# Altium project WCTopping.PrjPcb (part 1 of 2)
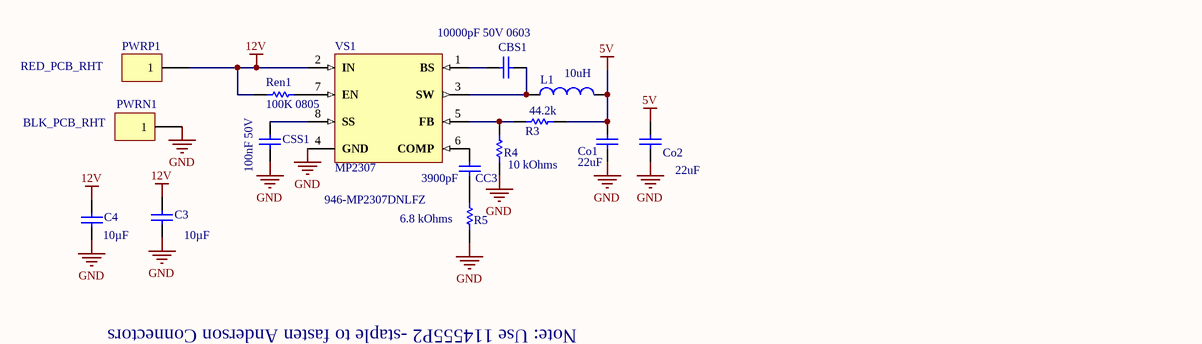
[diagram p0: Power Supply.SchDoc]
Project_Name: WC Topping; Revision: 1.2
5 sheets, 59 parts. Net scope: flat (ports and power ports of the same name join across sheets).
Board files: WCTopping.PcbDoc, WCToppingRouting.PcbDoc
Sheets:
  Power Supply.SchDoc
  Processor_Interface.SchDoc
  CAN_Interface.SchDoc
  Digital_IO.SchDoc
  Relay_IO.SchDoc

## Sheet Power Supply.SchDoc: Power Supply 5V @ 3A
size A; Engineer: H Potential; DocumentNumber: 5; Revision: 3.2; SheetNumber: 5; SheetTotal: 5

### Parts
C3  10µF  [CAPC2013X135X45ML10T25]
C4  10µF  [CAPC2013X135X45ML10T25]
CBS1  10000pF 50V 0603  [0603C_L]
CC3  3900pF  [0603C_L]
Co1  22uF  [0603C_L]
Co2  22uF  [0603C_L]
CSS1  100nF 50V  [0603C_L]
L1  10uH  [IND_1]
PWRN1  BLK_PCB_RHT  [Anderson_BLK_RHT_BOT]
PWRP1  RED_PCB_RHT  [Anderson_Red_RHT_BOT]
R3  44.2k  [0805_L]
R4  10 kOhms  [0805_L]
R5  6.8 kOhms  [0805_L]
Ren1  100K 0805  [0805_L]
VS1  MP2307  Supplier Part Number 1: 946-MP2307DNLFZ  [SOIC8N_EXP]

### Nets
5V: Co1.2 Co2.2 L1.2 R3.1
12V: C3.2 C4.2 PWRP1.1 Ren1.1 VS1.2(IN)
GND: C3.1 C4.1 Co1.1 Co2.1 CSS1.1 PWRN1.1 R4.2 R5.1 VS1.4(GND)
NetCBS1_1: CBS1.1 L1.1 VS1.3(SW)
NetCBS1_2: CBS1.2 VS1.1(BS)
NetCC3_1: CC3.1 R5.2
NetCC3_2: CC3.2 VS1.6(COMP)
NetCSS1_2: CSS1.2 VS1.8(SS)
NetR3_2: R3.2 R4.1 VS1.5(FB)
NetRen1_2: Ren1.2 VS1.7(EN)

### Notes on the sheet
- Note: Use 114555P2 -staple to fasten Anderson Connectors
- Title
- Size:
- Date:
- A
- Project:
- Time:
- Revision:
- Sheet
- of
- Engineer:
- File:

### Library data of the parts
C3 C4 = CMP-2007-03541-1: Part Number: GRM21BR61E106KA73L; Manufacturer: Murata; Product Training Modules: High-Cap Multilayer Ceramic Capacitors; Catalog Drawings: GRM Series_0805_1.25; Tolerance: ±10%; Voltage - Rated: 25V; Temperature Coefficient: X5R; Online Catalog: GRM Series; Other Names: 490-5523-6; Supplier 1: Digikey; Supplier Part Number 1: 490-5523-1-ND; Manufacturer Part Number: GRM21BR61E106KA73L; Stock 1: 750766; Pricing 1: 1=0.19, 10=0.13, 50=0.0748, 100=0.0618, 250=0.052, 500=0.0436, 1000=0.0358 (USD); Standard Package: 1; Category: Capacitors; Family: Ceramic Capacitors; Series: GRM; Packaging: Digi-Reel®; Capacitance: 10µF; Mounting Type: Surface Mount, MLCC; Operating Temperature: -55°C ~ 85°C; Applications: General Purpose; Ratings: -; Package / Case: 0805 (2012 Metric); Size / Dimension: 0.079" L x 0.049" W (2.00mm x 1.25mm); Height - Seated (Max): -; Thickness (Max): 0.053" (1.35mm); Lead Spacing: -; Features: -; Lead Style: -; ComponentLink1URL: https://datasheet.ciiva.com/139/partnumbering-e-01-139184.pdf; ComponentLink1Description: https://datasheet.ciiva.com/139/partnumbering-e-01-139184.pdf; ComponentLink2URL: https://datasheet.ciiva.com/28584/626718-28584288.pdf; ComponentLink2Description: https://datasheet.ciiva.com/28584/626718-28584288.pdf; ComponentLink3URL: https://datasheet.ciiva.com/16440/grm21br61e106ka73l-16440627.pdf; ComponentLink3Description: https://datasheet.ciiva.com/16440/grm21br61e106ka73l-16440627.pdf; ComponentLink4URL: https://datasheet.ciiva.com/7719/1747469-7719093.pdf; ComponentLink4Description: https://datasheet.ciiva.com/7719/1747469-7719093.pdf; ComponentLink5URL: https://datasheet.ciiva.com/5424/product-5424327.pdf; ComponentLink5Description: https://datasheet.ciiva.com/5424/product-5424327.pdf; ComponentLink6URL: https://datasheet.ciiva.com/28584/626718-28584279.pdf; ComponentLink6Description: https://datasheet.ciiva.com/28584/626718-28584279.pdf; ComponentLink7URL: https://datasheet.ciiva.com/14116/grmseries-highdielectrictype-eng-14116376.pdf; ComponentLink7Description: https://datasheet.ciiva.com/14116/grmseries-highdielectrictype-eng-14116376.pdf; ComponentLink8URL: https://datasheet.ciiva.com/22774/1747469-22774396.pdf; ComponentLink8Description: https://datasheet.ciiva.com/22774/1747469-22774396.pdf; ComponentLink9URL: https://datasheet.ciiva.com/139/partnumbering-e-01-139182.pdf; ComponentLink9Description: https://datasheet.ciiva.com/139/partnumbering-e-01-139182.pdf; ComponentLink10URL: https://datasheet.ciiva.com/139/partnumbering-e-01-139183.pdf; ComponentLink10Description: https://datasheet.ciiva.com/139/partnumbering-e-01-139183.pdf; ComponentLink11URL: https://datasheet.ciiva.com/29199/454623-da-01-en-vs-kondensator-0805-29199615.pdf; ComponentLink11Description: https://datasheet.ciiva.com/29199/454623-da-01-en-vs-kondensator-0805-29199615.pdf
CBS1 = Cap10000pF_50V_0603: Manufacturer: Yageo; Manufacturer Part Number: CC0603KRX7R9BB103; Product Training Modules: Multilayer Ceramic Capacitors; Featured Product: Commodity Multilayer Ceramic Capacitors – CC Series; Tolerance: ±10%; Temperature Coefficient: X7R; Online Catalog: CC Series; Other Names: 311-1085-6; Supplier 1: Digikey; Stock 1: 2765337; Pricing 1: 1=0.1, 10=0.018, 25=0.0132, 50=0.0098, 100=0.008, 250=0.0067, 500=0.0057, 1000=0.0045 (USD); Standard Package: 1; Category: Capacitors; Family: Ceramic Capacitors; Series: CC; Packaging: Digi-Reel®; Capacitance: 10000pF; Voltage - Rated: 50V; Mounting Type: Surface Mount, MLCC; Operating Temperature: -55°C ~ 125°C; Applications: General Purpose; Ratings: -; Package / Case: 0603 (1608 Metric); Size / Dimension: 0.063" L x 0.031" W (1.60mm x 0.80mm); Height - Seated (Max): -; Thickness (Max): 0.035" (0.90mm); Lead Spacing: -; Features: -; Lead Style: -; ComponentLink1URL: https://datasheet.ciiva.com/8033/1734573-8033861.pdf; ComponentLink1Description: https://datasheet.ciiva.com/8033/1734573-8033861.pdf; ComponentLink2URL: https://datasheet.ciiva.com/176/mlccorderingcode-176550.pdf; ComponentLink2Description: https://datasheet.ciiva.com/176/mlccorderingcode-176550.pdf; ComponentLink3URL: https://datasheet.ciiva.com/11788/0900766b8079c870-11788374.pdf; ComponentLink3Description: https://datasheet.ciiva.com/11788/0900766b8079c870-11788374.pdf; ComponentLink4URL: https://datasheet.ciiva.com/176/mlccorderingcode-176551.pdf; ComponentLink4Description: https://datasheet.ciiva.com/176/mlccorderingcode-176551.pdf; ComponentLink5URL: https://datasheet.ciiva.com/13389/upy-gphc-x7r-6-3v-to-50v-8-13389991.pdf; ComponentLink5Description: https://datasheet.ciiva.com/13389/upy-gphc-x7r-6-3v-to-50v-8-13389991.pdf; ComponentLink6URL: https://datasheet.ciiva.com/176/mlccorderingcode-176552.pdf; ComponentLink6Description: https://datasheet.ciiva.com/176/mlccorderingcode-176552.pdf; ComponentLink7URL: https://datasheet.ciiva.com/8033/1734573-8033816.pdf; ComponentLink7Description: https://datasheet.ciiva.com/8033/1734573-8033816.pdf; ComponentLink8URL: https://datasheet.ciiva.com/8033/70765-8033817.pdf; ComponentLink8Description: https://datasheet.ciiva.com/8033/70765-8033817.pdf; ComponentLink9URL: https://datasheet.ciiva.com/16625/upy-gphc-x7r-6-3v-to-50v-8-16625529.pdf; ComponentLink9Description: https://datasheet.ciiva.com/16625/upy-gphc-x7r-6-3v-to-50v-8-16625529.pdf; ComponentLink10URL: https://datasheet.ciiva.com/28450/1489800-28450619.pdf; ComponentLink10Description: https://datasheet.ciiva.com/28450/1489800-28450619.pdf; ComponentLink11URL: https://datasheet.ciiva.com/26862/getdatasheetpartid-403582-26862846.pdf; ComponentLink11Description: https://datasheet.ciiva.com/26862/getdatasheetpartid-403582-26862846.pdf; Supplier Part Number 1: 311-1085-1-ND
CC3 = Cap_0603_1: Manufacturer: Murata; Manufacturer Part Number: GRM188R71E392KA01D; Tolerance (+ or -): 10%; Voltage: 25VDC; Temp Coeff (Dielectric): X7R; Case Style: Ceramic Chip; Wire Form: Not Required; Product Length (mm): 1.6mm; Product Depth (mm): 0.8mm; Product Diameter (mm): Not Requiredmm; Supplier 1: Digikey; Supplier Part Number 1: 490-11525-1-ND; Stock 1: 12327; Pricing 1: 1=0.1, 10=0.072, 50=0.039, 100=0.033, 250=0.027, 500=0.0231, 1000=0.018 (USD); Capacitance: 3900pF; Operating Temp Range: -55C to 125C; Mounting Style: Surface Mount; Package / Case: 0603; Construction: SMT Chip; Failure Rate: Not Required; Product Height (mm): 0.8mm; Packaging: Tape and Reel; ComponentLink1URL: https://datasheet.ciiva.com/5420/product-5420128.pdf; ComponentLink1Description: https://datasheet.ciiva.com/5420/product-5420128.pdf; ComponentLink2URL: https://datasheet.ciiva.com/164/partnumbering-e-01-164755.pdf; ComponentLink2Description: https://datasheet.ciiva.com/164/partnumbering-e-01-164755.pdf
Co1 Co2 = Cap_0603_1: Manufacturer: Murata; Manufacturer Part Number: GRM188R60J226MEA0D; Tolerance (+ or -): 20%; Voltage: 6.3VDC; Temp Coeff (Dielectric): X5R; Case Style: Ceramic Chip; Wire Form: Not Required; Product Length (mm): 1.6mm; Product Depth (mm): 0.8mm; Product Diameter (mm): Not Requiredmm; Supplier 1: Digikey; Supplier Part Number 1: 490-7611-1-ND; Stock 1: 2044559; Pricing 1: 1=0.27, 10=0.182, 50=0.11, 100=0.0924, 250=0.0748, 500=0.066, 1000=0.0561 (USD); Capacitance: 22uF; Operating Temp Range: -55C to 125C; Mounting Style: Surface Mount; Package / Case: 0603; Construction: SMT Chip; Failure Rate: Not Required; Product Height (mm): 0.8mm; Packaging: Tape and Reel; ComponentLink1URL: https://datasheet.ciiva.com/29540/partnumbering-e-01-29540441.pdf; ComponentLink1Description: https://datasheet.ciiva.com/29540/partnumbering-e-01-29540441.pdf; ComponentLink2URL: https://datasheet.ciiva.com/29540/partnumbering-e-01-29540442.pdf; ComponentLink2Description: https://datasheet.ciiva.com/29540/partnumbering-e-01-29540442.pdf; ComponentLink3URL: https://datasheet.ciiva.com/29540/partnumbering-e-01-29540443.pdf; ComponentLink3Description: https://datasheet.ciiva.com/29540/partnumbering-e-01-29540443.pdf
CSS1 = Cap100nF_50V_0603: Manufacturer: Yageo; Manufacturer Part Number: CC0603ZRY5V9BB104; Capacitance: 0.10µF; Tolerance: -20%, +80%; Temperature Coefficient: Y5V (F); Supplier 1: Digi-Key; Supplier Part Number 1: 311-1343-1-ND; RoHS: RoHS Compliant; Category: Capacitors; Stock 1: 1827128; Pricing 1: 1=0.1, 10=0.018, 25=0.0128, 100=0.0082, 250=0.00672, 500=0.00574, 1000=0.00447 (USD); Packaging: Cut Tape (CT); Part Status: Active; Voltage - Rated: 50V; Operating Temperature: -30°C ~ 85°C; Features: -; Ratings: -; Applications: General Purpose; Failure Rate: -; Mounting Type: Surface Mount, MLCC; Package / Case: 0603 (1608 Metric); Size / Dimension: 0.063" L x 0.031" W (1.60mm x 0.80mm); Height - Seated (Max): -; Thickness (Max): 0.035" (0.90mm); Lead Spacing: -; Lead Style: -; ComponentLink1URL: http://www.yageo.com/documents/recent/UPY-GPHC_Y5V_6.3V-to-50V_6.pdf; ComponentLink1Description: http://www.yageo.com/documents/recent/UPY-GPHC_Y5V_6.3V-to-50V_6.pdf
L1 = Inductor: Manufacturer: Abracon; Manufacturer Part Number: ASPI-0630LR-100M-T15; Code_IEC: 1005; Rad Hard: No; Type: Power; Maximum DC Current: 4 A; Tolerance: 20 %; Maximum DC Resistance: 68 mOhm; Product Depth: 6.65 mm; Product Height: 3(Max) mm; Published: 8-Jun-2000; LatestRevisionDate: 29-May-2009; LatestRevisionNote: IPC-7351 Footprint Added.; Publisher: Altium Limited; PackageDescription: Chip Inductor; Code_JEITA: 0402; Value: 10uH; Supplier 1: Digikey; Stock 1: 9671; Pricing 1: 1=0.81, 10=0.706, 25=0.6552, 50=0.5544, 100=0.504, 250=0.4738, 500=0.4234 (USD); Package/Case: 2826; Packaging: Tape & Reel; Inductance: 10 uH; Category: Inductor Surface Mount; ComponentLink1URL: https://datasheet.ciiva.com/29994/aspi-0630lr-29994299.pdf; ComponentLink1Description: https://datasheet.ciiva.com/29994/aspi-0630lr-29994299.pdf; Supplier Part Number 1: ASPI-0630LR-100M-T15CT-ND
PWRN1 = Anderson-1Pin BLK_PCB_RHT: 1 pin Anderson; Manufacturer: Anderson Power Products (APP); Manufacturer Part Number: 1377G1, 1377G2, 1327-BK,137G6-BK; Number of Positions / Contacts: 1; Voltage Rating: 600 V; Current Rating: 25 A; Mouser: 879-1327G6; Mouser: 879-1327; Mouser: 879-1377G2; Mouser: 879-1377G1; Supplier 1: Mouser; Stock 1: 233; Pricing 1: 1=1.14, 10=1.14, 50=0.947, 100=0.901, 1000=0.777, 10000=0.777 (USD); Termination Style: Solder; Series: PCB Powerpole; Product Type: Contacts; Contact Material: Copper Alloy; Contact Plating: Tin; ComponentLink1URL: http://components.arrow.com/part/dataview/0323_01933244; ComponentLink1Description: http://components.arrow.com/part/dataview/0323_01933244; ComponentLink2URL: http://www.andersonpower.com/files.php?file=CAT-PPMP(4).pdf; ComponentLink2Description: http://www.andersonpower.com/files.php?file=CAT-PPMP(4).pdf; Supplier Part Number 2: 879-1377G2; Supplier Part Number 1: 879-1377G1; Supplier Part Number 3: 879-1327G6; Supplier Part Number 4: 879-1327
PWRP1 = Anderson-1Pin RED_PCB_RHT: 1 pin Anderson; Manufacturer: Anderson Power Products (APP); Manufacturer Part Number: 1377G1, 1377G2, 1327-BK,137G6-BK; Number of Positions / Contacts: 1; Voltage Rating: 600 V; Current Rating: 25 A; Mouser: 879-1327G6; Mouser: 879-1327; Mouser: 879-1377G2; Mouser: 879-1377G1; Supplier 1: Mouser; Stock 1: 233; Pricing 1: 1=1.14, 10=1.14, 50=0.947, 100=0.901, 1000=0.777, 10000=0.777 (USD); Termination Style: Solder; Series: PCB Powerpole; Product Type: Contacts; Contact Material: Copper Alloy; Contact Plating: Tin; ComponentLink1URL: http://components.arrow.com/part/dataview/0323_01933244; ComponentLink1Description: http://components.arrow.com/part/dataview/0323_01933244; ComponentLink2URL: http://www.andersonpower.com/files.php?file=CAT-PPMP(4).pdf; ComponentLink2Description: http://www.andersonpower.com/files.php?file=CAT-PPMP(4).pdf; Supplier Part Number 2: 879-1377G2; Supplier Part Number 1: 879-1377G1; Supplier Part Number 3: 879-1327G6; Supplier Part Number 4: 879-1327
R3 = Res_0805: Manufacturer: Yageo; Manufacturer Part Number: RC0805FR-0744K2L; Product Training Modules: Chip Resistor; Catalog Drawings: Thick Film Resistor Side; PCN Other: RC/AC 0603/0805/1206 22/Jan/2013; HTML Datasheet: RC Series, L Suffix Datasheet.html; EDA / CAD Models: Download from Accelerated Designs; Tolerance: ±1%; Power (Watts): 0.125W, 1/8W; Temperature Coefficient: ±100ppm/°C; Online Catalog: RC0805 Series; Kits: PHC5A-KIT-ND  - RESISTOR KIT 10K-97.6K 1/8W PHC5-KIT-ND  - RESISTOR KIT 10K-97.6K 1/8W; Other Names: 311-44.2KCRCT; Supplier 1: Digikey; Supplier Part Number 1: 311-44.2KCRCT-ND; Stock 1: 52103; Pricing 1: 1=0.1, 10=0.019, 25=0.0136, 50=0.0104, 100=0.0077, 250=0.0058, 500=0.0047, 1000=0.0035 (USD); Standard Package: 1; Category: Resistors; Family: Chip Resistor - Surface Mount; Series: RC; Packaging: Cut Tape (CT); Resistance (Ohms): 44.2k; Composition: Thick Film; Features: Moisture Resistant; Operating Temperature: -55°C ~ 155°C; Package / Case: 0805 (2012 Metric); Supplier Device Package: 0805; Size / Dimension: 0.079" L x 0.049" W (2.00mm x 1.25mm); Height: 0.024" (0.60mm); Number of Terminations: 2; ComponentLink1URL: https://datasheet.ciiva.com/2519/pyu-r-int-thick-7-2519792.pdf; ComponentLink1Description: https://datasheet.ciiva.com/2519/pyu-r-int-thick-7-2519792.pdf; ComponentLink2URL: https://datasheet.ciiva.com/2519/pyu-r-int-thick-7-2519793.pdf; ComponentLink2Description: https://datasheet.ciiva.com/2519/pyu-r-int-thick-7-2519793.pdf; ComponentLink3URL: https://datasheet.ciiva.com/2519/pyu-r-int-thick-7-2519794.pdf; ComponentLink3Description: https://datasheet.ciiva.com/2519/pyu-r-int-thick-7-2519794.pdf; ComponentLink4URL: https://datasheet.ciiva.com/17074/rc0805-17074805.pdf; ComponentLink4Description: https://datasheet.ciiva.com/17074/rc0805-17074805.pdf
R4 = Res_0805: Manufacturer: Yageo; Manufacturer Part Number: RC0805FR-0710KL; Tolerance: 1 %; Power Rating: 125 mW (1/8 W); Voltage Rating: 150 V; Temperature Coefficient: 100 PPM / C; Supplier 1: Digikey; Supplier Part Number 1: 311-10.0KCRCT-ND; Stock 1: 8894385; Pricing 1: 1=0.1, 10=0.019, 25=0.0136, 50=0.0104, 100=0.0077, 250=0.0058, 500=0.0047, 1000=0.0035 (USD); Termination Style: SMD/SMT; Product: Thick Film Resistors General Purpose; Resistance: 10 kOhms; Case Code - in: 0805; Case Code - mm: 2012; Series: RC; Operating Temperature Range: - 55 C to + 155 C; Packaging: Reel; ComponentLink1URL: https://datasheet.ciiva.com/11808/0900766b8106beab-11808151.pdf; ComponentLink1Description: https://datasheet.ciiva.com/11808/0900766b8106beab-11808151.pdf; ComponentLink2URL: https://datasheet.ciiva.com/12669/rc0805-12669688.pdf; ComponentLink2Description: https://datasheet.ciiva.com/12669/rc0805-12669688.pdf; ComponentLink3URL: https://datasheet.ciiva.com/46447/444164-46447563.pdf; ComponentLink3Description: https://datasheet.ciiva.com/46447/444164-46447563.pdf; ComponentLink4URL: https://datasheet.ciiva.com/2456/pyu-r-int-thick-7-2456972.pdf; ComponentLink4Description: https://datasheet.ciiva.com/2456/pyu-r-int-thick-7-2456972.pdf; ComponentLink5URL: https://datasheet.ciiva.com/2456/pyu-r-int-thick-7-2456973.pdf; ComponentLink5Description: https://datasheet.ciiva.com/2456/pyu-r-int-thick-7-2456973.pdf; ComponentLink6URL: https://datasheet.ciiva.com/2456/pyu-r-int-thick-7-2456974.pdf; ComponentLink6Description: https://datasheet.ciiva.com/2456/pyu-r-int-thick-7-2456974.pdf; ComponentLink7URL: https://datasheet.ciiva.com/16747/rc0805-16747087.pdf; ComponentLink7Description: https://datasheet.ciiva.com/16747/rc0805-16747087.pdf
R5 = Res_0805: Manufacturer: Yageo; Manufacturer Part Number: RC0805JR-076K8L; Tolerance: 5 %; Power Rating: 125 mW (1/8 W); Voltage Rating: 150 V; Temperature Coefficient: 100 PPM / C; Supplier 1: Digikey; Supplier Part Number 1: 311-6.8KARCT-ND; Stock 1: 71971; Pricing 1: 1=0.1, 10=0.016, 25=0.0116, 50=0.009, 100=0.0066, 250=0.005, 500=0.004, 1000=0.003 (USD); Termination Style: SMD/SMT; Product: Thick Film Resistors General Purpose; Resistance: 6.8 kOhms; Case Code - in: 0805; Case Code - mm: 2012; Series: RC; Operating Temperature Range: - 55 C to + 155 C; Packaging: Reel; ComponentLink1URL: https://datasheet.ciiva.com/2456/pyu-r-int-thick-7-2456128.pdf; ComponentLink1Description: https://datasheet.ciiva.com/2456/pyu-r-int-thick-7-2456128.pdf; ComponentLink2URL: https://datasheet.ciiva.com/2456/pyu-r-int-thick-7-2456129.pdf; ComponentLink2Description: https://datasheet.ciiva.com/2456/pyu-r-int-thick-7-2456129.pdf; ComponentLink3URL: https://datasheet.ciiva.com/2456/pyu-r-int-thick-7-2456130.pdf; ComponentLink3Description: https://datasheet.ciiva.com/2456/pyu-r-int-thick-7-2456130.pdf; ComponentLink4URL: https://datasheet.ciiva.com/17196/rc0805-17196091.pdf; ComponentLink4Description: https://datasheet.ciiva.com/17196/rc0805-17196091.pdf; ComponentLink5URL: https://datasheet.ciiva.com/7941/442941-7941997.pdf; ComponentLink5Description: https://datasheet.ciiva.com/7941/442941-7941997.pdf; ComponentLink6URL: https://datasheet.ciiva.com/7941/442941-7941998.pdf; ComponentLink6Description: https://datasheet.ciiva.com/7941/442941-7941998.pdf; ComponentLink7URL: https://datasheet.ciiva.com/12666/rc0805-12666991.pdf; ComponentLink7Description: https://datasheet.ciiva.com/12666/rc0805-12666991.pdf
Ren1 = Res100K_080: Manufacturer: Panasonic / Panasonic ECG; Manufacturer Part Number: ERJ-6GEYJ104V; Rated Power: 0.125 W; Resistance: 100 kO; Tolerance (%): ±5 %; Temp Coefficient: ±200 ppm/°C; Supplier 1: Digikey; Stock 1: 748133; Pricing 1: 1=0.1, 50=0.015, 100=0.011, 250=0.0084, 500=0.0067, 1000=0.005 (USD); ComponentLink1URL: https://datasheet.ciiva.com/11821/0900766b80f806dd-11821506.pdf; ComponentLink1Description: https://datasheet.ciiva.com/11821/0900766b80f806dd-11821506.pdf; Supplier Part Number 1: P100KACT-ND; Size Code: 0805; ComponentLink2URL: https://datasheet.ciiva.com/16771/70255313-16771462.pdf; ComponentLink2Description: https://datasheet.ciiva.com/16771/70255313-16771462.pdf; ComponentLink3URL: https://datasheet.ciiva.com/43460/1500035-43460136.pdf; ComponentLink3Description: https://datasheet.ciiva.com/43460/1500035-43460136.pdf; ComponentLink4URL: https://datasheet.ciiva.com/22758/1500035-22758234.pdf; ComponentLink4Description: https://datasheet.ciiva.com/22758/1500035-22758234.pdf; ComponentLink5URL: https://datasheet.ciiva.com/17208/aoa0000ce1-17208156.pdf; ComponentLink5Description: https://datasheet.ciiva.com/17208/aoa0000ce1-17208156.pdf; ComponentLink6URL: https://datasheet.ciiva.com/30137/4aoa0000ce1-30137389.pdf; ComponentLink6Description: https://datasheet.ciiva.com/30137/4aoa0000ce1-30137389.pdf; ComponentLink7URL: https://datasheet.ciiva.com/9117/aoa0000ce1-9117374.pdf; ComponentLink7Description: https://datasheet.ciiva.com/9117/aoa0000ce1-9117374.pdf; ComponentLink8URL: https://datasheet.ciiva.com/34303/2007290-34303759.pdf; ComponentLink8Description: https://datasheet.ciiva.com/34303/2007290-34303759.pdf; ComponentLink9URL: https://datasheet.ciiva.com/46380/1500035-46380511.pdf; ComponentLink9Description: https://datasheet.ciiva.com/46380/1500035-46380511.pdf
VS1 = MP2307: Manufacturer: Monolithic Power Systems (MPS); Manufacturer Part Number: MP2307DN-LF-Z; Input Voltage MAX: 23 V; Switching Frequency: 340 kHz; Output Voltage: 0.925 V to 20 V; Output Current: 3 A; Number of Outputs: 1 Output; Input Voltage MIN: 4.75 V; Supply Current: 1.3 mA; Topology: Buck; Supplier 1: Mouser; Stock 1: 1758; Pricing 1: 1=4, 10=3.31, 50=3.31, 100=2.93, 1000=1.99, 10000=1.89 (USD); Product Category: Voltage Regulators - Switching Regulators; RoHS: Details; Maximum Operating Temperature: + 85 C; Mounting Style: SMD/SMT; Package / Case: SOIC-8 EP; Brand: Monolithic Power Systems (MPS); Minimum Operating Temperature: - 40 C; Packaging: Reel; Series: MP2307DN; Factory Pack Quantity: 2500; Type: Step-Down DC/DC Converter; ComponentLink1URL: https://datasheet.ciiva.com/12215/mp2307-r1-9-371737-12215450.pdf; ComponentLink1Description: https://datasheet.ciiva.com/12215/mp2307-r1-9-371737-12215450.pdf

## Sheet Processor_Interface.SchDoc: Processor 40pin GPIO Interface
size A; Engineer: D Board; DocumentNumber: 1; Revision: 1.2c; SheetNumber: 1; SheetTotal: 5
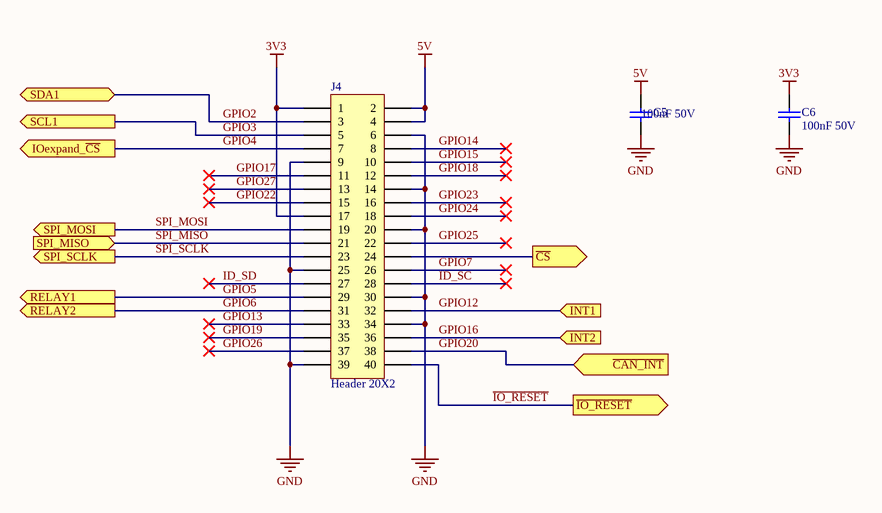
[diagram p1: Processor_Interface.SchDoc]

### Parts
C5  100nF 50V  [0603C_L]
C6  100nF 50V  [0603C_L]
J4  Header 20X2  [HDR2X20]

### Ports
INT1 (in), INT2 (in), IOexpand_~{CS} (out), RELAY1 (out), RELAY2 (out), SCL1 (out), SDA1 (bidir), SPI_MISO (in), SPI_MOSI (out), SPI_SCLK (out), ~{CAN_INT} (in), ~{CS} (out), ~{IO_RESET} (out)

### Nets
3V3: C6.2 J4.1 J4.17
5V: C5.2 J4.2 J4.4
GND: C5.1 C6.1 J4.6 J4.9 J4.14 J4.20 J4.25 J4.30 J4.34 J4.39
~{IO_RESET}: J4.40 ; port ~{IO_RESET}
~{CS}: J4.24 ; port ~{CS}
GPIO2: J4.3 ; port SDA1
GPIO3: J4.5 ; port SCL1
GPIO4: J4.7 ; port IOexpand_~{CS}
GPIO5: J4.29 ; port RELAY1
GPIO6: J4.31 ; port RELAY2
GPIO7: J4.26
GPIO12: J4.32 ; port INT1
GPIO13: J4.33
GPIO14: J4.8
GPIO15: J4.10
GPIO16: J4.36 ; port INT2
GPIO17: J4.11
GPIO18: J4.12
GPIO19: J4.35
GPIO20: J4.38 ; port ~{CAN_INT}
GPIO22: J4.15
GPIO23: J4.16
GPIO24: J4.18
GPIO25: J4.22
GPIO26: J4.37
GPIO27: J4.13
ID_SC: J4.28
ID_SD: J4.27
SPI_MISO: J4.21 ; port SPI_MISO
SPI_MOSI: J4.19 ; port SPI_MOSI
SPI_SCLK: J4.23 ; port SPI_SCLK

### Notes on the sheet
- Title
- Size:
- Date:
- A
- Project:
- Time:
- Revision:
- Sheet
- of
- Engineer:
- File:

### Library data of the parts
C5 C6 = Cap100nF_50V_0603: as CSS1 on sheet Power Supply; Supplier 1: Digi-Key; Supplier Part Number 1: 311-1343-1-ND; RoHS: RoHS Compliant; Category: Capacitors; Stock 1: 1827128; Pricing 1: 1=0.1, 10=0.018, 25=0.0128, 100=0.0082, 250=0.00672, 500=0.00574, 1000=0.00447 (USD); Packaging: Cut Tape (CT); Part Status: Active; Voltage - Rated: 50V; Operating Temperature: -30°C ~ 85°C; Features: -; Ratings: -; Applications: General Purpose; Failure Rate: -; Mounting Type: Surface Mount, MLCC; Package / Case: 0603 (1608 Metric); Size / Dimension: 0.063" L x 0.031" W (1.60mm x 0.80mm); Height - Seated (Max): -; Thickness (Max): 0.035" (0.90mm); Lead Spacing: -; Lead Style: -; ComponentLink1URL: http://www.yageo.com/documents/recent/UPY-GPHC_Y5V_6.3V-to-50V_6.pdf; ComponentLink1Description: http://www.yageo.com/documents/recent/UPY-GPHC_Y5V_6.3V-to-50V_6.pdf
J4 = Header 20X2: Header, 20-Pin, Dual row; LatestRevisionDate: 17-Jul-2002; LatestRevisionNote: Re-released for DXP Platform.; Publisher: Altium Limited

## Sheet CAN_Interface.SchDoc: CAN Bus Interface Logic
size B; Engineer: Daisy Chain; DocumentNumber: 3; Revision: 2.3; SheetNumber: 3; SheetTotal: 5
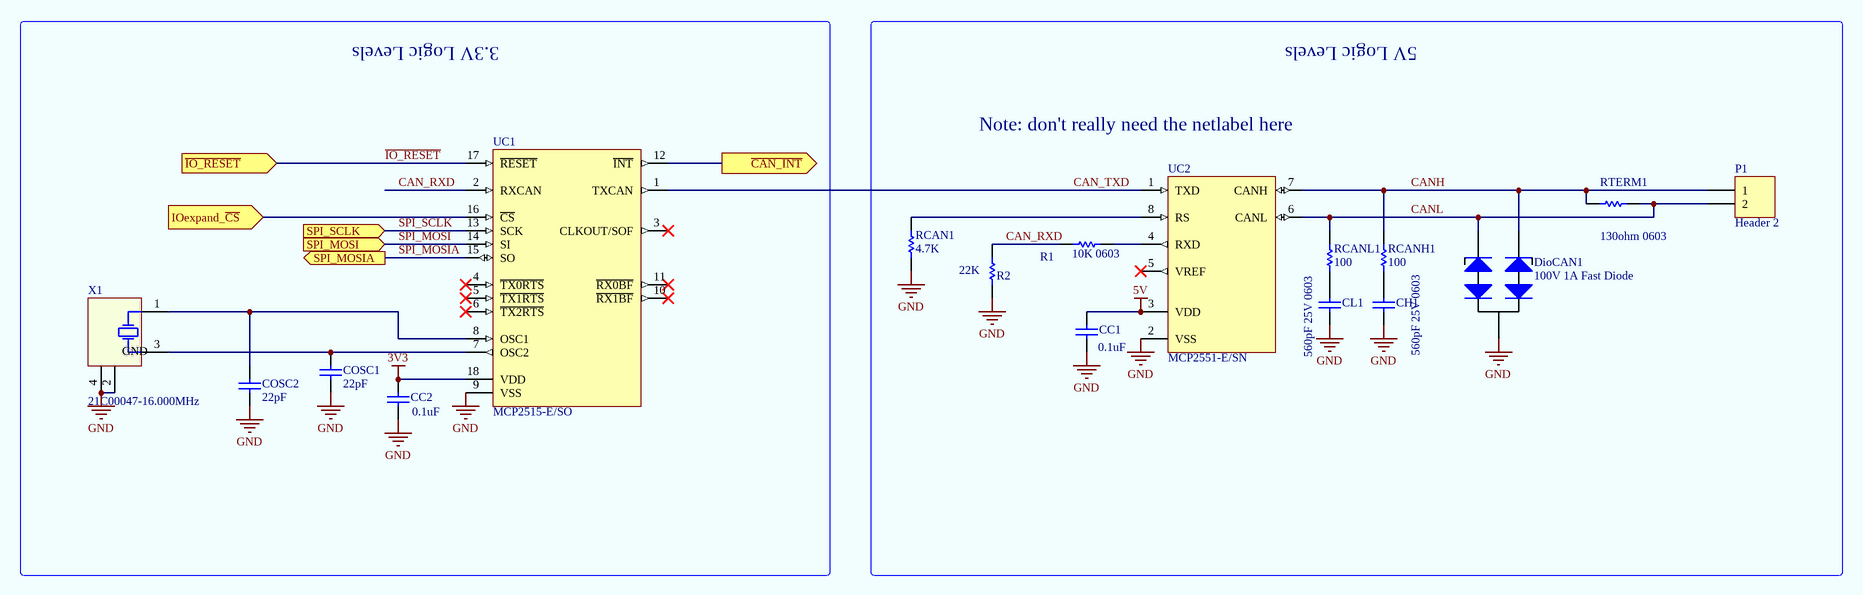
[diagram p2: CAN_Interface.SchDoc]

### Parts
CC1  0.1uF  [0603C_L]
CC2  0.1uF  [0603C_L]
CH1  560pF 25V 0603  [0603C_L]
CL1  560pF 25V 0603  [0603C_L]
COSC1  22pF  [0603C_L]
COSC2  22pF  [0603C_L]
DioCAN1  100V 1A Fast Diode  [SOT23]
P1  Header 2  [HDR1X2]
R1  10K 0603  [0603_L]
R2  22K  [0603_L]
RCAN1  4.7K  [0603_L]
RCANH1  100  [0603_L]
RCANL1  100  [0603_L]
RTERM1  130ohm 0603  [0603_L]
UC1  MCP2515-E/SO  [SOIC-SO18_M]
UC2  MCP2551-E/SN  [SOIC-SN8_N]
X1  21C00047-16.000MHz  [ITTI-21C00047-16.000MHz-4_V]

### Blocks framed on the sheet
3.3V Logic Levels: CC2 COSC1 COSC2 UC1 X1

### Ports
IOexpand_~{CS} (in), SPI_MOSI (in), SPI_MOSIA (out), SPI_SCLK (in), ~{CAN_INT} (out), ~{IO_RESET} (in)

### Nets
3V3: CC2.2 UC1.18(VDD)
5V: CC1.2 UC2.3(VDD)
GND: CC1.1 CC2.1 CH1.2 CL1.1 COSC1.1 COSC2.2 DioCAN1.3 R2.1 RCAN1.1 UC1.9(VSS) UC2.2(VSS) X1.2(GND) X1.4(GND)
~{IO_RESET}: UC1.17(~{RESET}) ; port ~{IO_RESET}
CAN_RXD: R1.2 R2.2 UC1.2(RXCAN)
CAN_TXD: UC1.1(TXCAN) UC2.1(TXD)
CANH: DioCAN1.1(A) P1.1 RCANH1.2 RTERM1.2 UC2.7(CANH)
CANL: DioCAN1.2(K) P1.2 RCANL1.2 RTERM1.1 UC2.6(CANL)
GPIO4: UC1.16(~{CS}) ; port IOexpand_~{CS}
GPIO20: UC1.12(~{INT}) ; port ~{CAN_INT}
SPI_MOSI: UC1.14(SI) ; port SPI_MOSI
SPI_MOSIA: UC1.15(SO) ; port SPI_MOSIA
SPI_SCLK: UC1.13(SCK) ; port SPI_SCLK
NetCH1_1: CH1.1 RCANH1.1
NetCL1_2: CL1.2 RCANL1.1
NetCOSC1_2: COSC1.2 UC1.7(OSC2) X1.3(XTAL)
NetCOSC2_1: COSC2.1 UC1.8(OSC1) X1.1(XTAL)
NetR1_1: R1.1 UC2.4(RXD)
NetRCAN1_2: RCAN1.2 UC2.8(RS)

Not connected (* = marked no-connect by the designer): UC1 3(CLKOUT/SOF)* 4(~{TX0RTS})* 5(~{TX1RTS})* 6(~{TX2RTS})* 10(~{RX1BF})* 11(~{RX0BF})*; UC2 5(VREF)*

### Notes on the sheet
- 5V Logic Levels
- Note: don't really need the netlabel here
- Title
- Size:
- Date:
- B
- Project:
- Time:
- Revision:
- Sheet
- of
- Engineer:
- File:

### Library data of the parts
CC1 CC2 = Cap10uF_25V_0603
CH1 CL1 = Cap10uF_25V_0603: Manufacturer: Taiyo Yuden; Manufacturer Part Number: TMK316F106ZL-T; Catalog Drawings: xMK Series_1206_1.6; Capacitance: 10µF; Tolerance: -20%, +80%; Temperature Coefficient: Y5V (F); Online Catalog: M Series; Other Names: 587-1353-6; Supplier 1: Ciiva; Stock 1: 330483; Pricing 1: 1=0.34, 10=0.255, 50=0.1488, 100=0.119, 250=0.085, 500=0.0578, 1000=0.0468 (USD); Standard Package: 1; Category: Capacitors; Family: Ceramic Capacitors; Series: M; Packaging: Digi-Reel®; Voltage - Rated: 25V; Mounting Type: Surface Mount, MLCC; Operating Temperature: -30°C ~ 85°C; Applications: General Purpose; Ratings: -; Package / Case: 1206 (3216 Metric); Size / Dimension: 0.126" L x 0.063" W (3.20mm x 1.60mm); Height - Seated (Max): -; Thickness (Max): 0.071" (1.80mm); Lead Spacing: -; Features: -; Lead Style: -; ComponentLink1URL: https://datasheet.ciiva.com/30217/73tmk316f106zl-t-30217817.pdf; ComponentLink1Description: https://datasheet.ciiva.com/30217/73tmk316f106zl-t-30217817.pdf; ComponentLink2URL: https://datasheet.ciiva.com/11596/tmk316f106zl-t-ss-11596490.pdf; ComponentLink2Description: https://datasheet.ciiva.com/11596/tmk316f106zl-t-ss-11596490.pdf; ComponentLink3URL: https://datasheet.ciiva.com/137/tmk316f106zl-t-ss-137061.pdf; ComponentLink3Description: https://datasheet.ciiva.com/137/tmk316f106zl-t-ss-137061.pdf; ComponentLink4URL: https://datasheet.ciiva.com/15922/1123tmk316f106zl-t-15922467.pdf; ComponentLink4Description: https://datasheet.ciiva.com/15922/1123tmk316f106zl-t-15922467.pdf; ComponentLink5URL: https://datasheet.ciiva.com/7975/746258-7975854.pdf; ComponentLink5Description: https://datasheet.ciiva.com/7975/746258-7975854.pdf; ComponentLink6URL: https://datasheet.ciiva.com/7975/1693457-7975853.pdf; ComponentLink6Description: https://datasheet.ciiva.com/7975/1693457-7975853.pdf; ComponentLink7URL: https://datasheet.ciiva.com/5744/1497285-5744889.pdf; ComponentLink7Description: https://datasheet.ciiva.com/5744/1497285-5744889.pdf; Supplier Part Number 1: 587-1353-1-ND
COSC1 COSC2 = Cap100nF_50V_0603: Manufacturer: Murata; Manufacturer Part Number: GRM1885C1H220JA01D; Capacitance: 22; Voltage Rating: 50; Tolerance: 5; Type (Capacitors): C0G; Supplier 1: Digikey; Supplier Part Number 1: 490-1411-1-ND; Stock 1: 517556; Pricing 1: 1=0.1, 10=0.061, 50=0.0332, 100=0.0281, 250=0.023, 500=0.0196, 1000=0.0153 (USD); Mount: Surface Mount; Case/Package: 0603; Pins: 2; Case Code (Metric): 1608; Case Code (Imperial): 0603; Min Operating Temperature: -55; Max Operating Temperature: 125; Package Quantity: 1; Packaging: Cut Tape; Voltage Rating (DC): 50; Lead Pitch: 4; Length: 1.6; Height: 0.8; Width: 0.8; Radiation Hardening: No; REACH SVHC: No SVHC; ComponentLink1URL: https://datasheet.ciiva.com/131/product-131760.pdf; ComponentLink1Description: https://datasheet.ciiva.com/131/product-131760.pdf; ComponentLink2URL: https://datasheet.ciiva.com/131/partnumbering-e-01-131761.pdf; ComponentLink2Description: https://datasheet.ciiva.com/131/partnumbering-e-01-131761.pdf; ComponentLink3URL: https://datasheet.ciiva.com/14116/grmseries-tc-hitype-eng-14116853.pdf; ComponentLink3Description: https://datasheet.ciiva.com/14116/grmseries-tc-hitype-eng-14116853.pdf; ComponentLink4URL: https://datasheet.ciiva.com/3776/1156grm1885c1h220ja0123-3776984.pdf; ComponentLink4Description: https://datasheet.ciiva.com/3776/1156grm1885c1h220ja0123-3776984.pdf; ComponentLink5URL: https://datasheet.ciiva.com/14116/grmseries-tc-hitype-eng-14116826.pdf; ComponentLink5Description: https://datasheet.ciiva.com/14116/grmseries-tc-hitype-eng-14116826.pdf; ComponentLink6URL: https://datasheet.ciiva.com/11786/0900766b807a1cab-11786398.pdf; ComponentLink6Description: https://datasheet.ciiva.com/11786/0900766b807a1cab-11786398.pdf; ComponentLink7URL: https://datasheet.ciiva.com/131/partnumbering-e-01-131759.pdf; ComponentLink7Description: https://datasheet.ciiva.com/131/partnumbering-e-01-131759.pdf
DioCAN1 = PESD1CAN: High Conductance Fast Diode; Manufacturer: ON Semiconductor; Manufacturer Part Number: MUR110RLG; Diode Case Style: DO-204AL; Diode Configuration: Single; Diode Type: Fast Recovery; Forward Surge Current Ifsm Max: 35A; Forward Voltage VF Max: 1.25V; No. of Pins: 2; Reverse Recovery Time trr Max: 75ns; SVHC: No SVHC (16-Jun-2014); Supplier 1: Ciiva; Supplier Part Number 1: MUR110RLGOSCT-ND; Stock 1: 22453; Pricing 1: 1=0.48, 10=0.362, 100=0.2254, 500=0.1541, 1000=0.1185 (USD); Forward Current If(AV): 1A; Operating Temperature Max: 175°C; Packaging: Each; Repetitive Reverse Voltage Vrrm Max: 100V; ComponentLink1URL: https://datasheet.ciiva.com/915/mur120-d-915616.pdf; ComponentLink1Description: https://datasheet.ciiva.com/915/mur120-d-915616.pdf; ComponentLink2URL: https://datasheet.ciiva.com/30479/0900766b812212ee-30479481.pdf; ComponentLink2Description: https://datasheet.ciiva.com/30479/0900766b812212ee-30479481.pdf; ComponentLink3URL: https://datasheet.ciiva.com/25950/mur120-d-25950702.pdf; ComponentLink3Description: https://datasheet.ciiva.com/25950/mur120-d-25950702.pdf; ComponentLink4URL: https://datasheet.ciiva.com/16474/mur120-d-16474333.pdf; ComponentLink4Description: https://datasheet.ciiva.com/16474/mur120-d-16474333.pdf; ComponentLink5URL: https://datasheet.ciiva.com/915/mur120-d-915618.pdf; ComponentLink5Description: https://datasheet.ciiva.com/915/mur120-d-915618.pdf; ComponentLink6URL: https://datasheet.ciiva.com/915/mur120-d-915619.pdf; ComponentLink6Description: https://datasheet.ciiva.com/915/mur120-d-915619.pdf; ComponentLink7URL: https://datasheet.ciiva.com/16208/mur120-d-16208137.pdf; ComponentLink7Description: https://datasheet.ciiva.com/16208/mur120-d-16208137.pdf
P1 = Header 2: Header, 2-Pin; LatestRevisionDate: 17-Jul-2002; LatestRevisionNote: Re-released for DXP Platform.; Publisher: Altium Limited
R1 = Res4K99_0603: Manufacturer: Yageo; Manufacturer Part Number: RT0603DRD074K99L; Tolerance: ±0.5%; Power (Watts): 0.1W, 1/10W; Temperature Coefficient: ±25ppm/°C; Supplier 1: Digi-Key; RoHS: RoHS Compliant; Category: Resistors; Stock 1: 28874; Pricing 1: 1=0.22, 10=0.184, 25=0.134, 100=0.0721, 250=0.05532, 500=0.04358, 1000=0.03018, 2500=0.02766 (USD); Packaging: Cut Tape (CT); Part Status: Active; Resistance (Ohms): 10K; Composition: Thin Film; Features: Moisture Resistant; Operating Temperature: -55°C ~ 155°C; Package / Case: 0603 (1608 Metric); Supplier Device Package: 0603; Size / Dimension: 0.063" L x 0.031" W (1.60mm x 0.80mm); Height: 0.022" (0.55mm); Number of Terminations: 2; Failure Rate: -; ComponentLink1URL: http://www.yageo.com/documents/recent/PYu-RT_1-to-0.05_RoHS_L_6.pdf; ComponentLink1Description: http://www.yageo.com/documents/recent/PYu-RT_1-to-0.05_RoHS_L_6.pdf; Supplier Part Number 1: 311-10KDCT-ND
R2 = Res_0603: Manufacturer: Yageo; Manufacturer Part Number: RT0603DRD0722KL; Resistance: 22 kOhms; Tolerance: 0.5 %; Power Rating: 100 mW; Temperature Coefficient: 25 PPM / C; Voltage Rating: 75 V; Unit Weight: 0.000071 oz; Supplier 1: Digikey; Supplier Part Number 1: 311-22KDDKR-ND; Stock 1: 39729; Pricing 1: 1=0.12, 10=0.104, 25=0.0716, 50=0.0558, 100=0.0399, 250=0.0311, 500=0.0247, 1000=0.0175 (USD); Product Category: Thin Film Resistors - SMD; RoHS: True; Case Code - in: 0603; Case Code - mm: 1608; Operating Temperature Range: - 55 C to + 125 C; Series: RT; Packaging: Reel; Brand: Yageo; Height: 0.45 mm; Length: 1.6 mm; Package / Case: 0603 (1608 metric); Product: Thin Film Resistors SMD; Termination Style: SMD/SMT; Type: High Precision, High Stability; Width: 0.8 mm; ComponentLink1URL: https://datasheet.ciiva.com/12810/pyu-rt-1-to-0-05-rohs-l-4-12810773.pdf; ComponentLink1Description: https://datasheet.ciiva.com/12810/pyu-rt-1-to-0-05-rohs-l-4-12810773.pdf
RCAN1 = Res4K99_0603: Manufacturer: Yageo; Manufacturer Part Number: RT0603DRD074K99L; Resistance (Ohms): 4.99k; Tolerance: ±0.5%; Power (Watts): 0.1W, 1/10W; Temperature Coefficient: ±25ppm/°C; Supplier 1: Digi-Key; RoHS: RoHS Compliant; Category: Resistors; Stock 1: 28874; Pricing 1: 1=0.22, 10=0.184, 25=0.134, 100=0.0721, 250=0.05532, 500=0.04358, 1000=0.03018, 2500=0.02766 (USD); Packaging: Cut Tape (CT); Part Status: Active; Composition: Thin Film; Features: Moisture Resistant; Operating Temperature: -55°C ~ 155°C; Package / Case: 0603 (1608 Metric); Supplier Device Package: 0603; Size / Dimension: 0.063" L x 0.031" W (1.60mm x 0.80mm); Height: 0.022" (0.55mm); Number of Terminations: 2; Failure Rate: -; ComponentLink1URL: http://www.yageo.com/documents/recent/PYu-RT_1-to-0.05_RoHS_L_6.pdf; ComponentLink1Description: http://www.yageo.com/documents/recent/PYu-RT_1-to-0.05_RoHS_L_6.pdf; Supplier Part Number 1: 311-4.99KDCT-ND
RCANH1 RCANL1 = Res330_0603: Manufacturer: Yageo; Manufacturer Part Number: RC0603JR-07330RL; Resistance (Ohms): 330; Tolerance: ±5%; Power (Watts): 0.1W, 1/10W; Temperature Coefficient: ±100ppm/°C; Supplier 1: Digi-Key; RoHS: RoHS Compliant; Category: Resistors; Stock 1: 1303594; Pricing 1: 1=0.1, 10=0.011, 25=0.008, 100=0.0044, 250=0.00336, 500=0.0027, 1000=0.00198, 2500=0.00172 (USD); Packaging: Cut Tape (CT); Part Status: Active; Composition: Thick Film; Features: Moisture Resistant; Operating Temperature: -55°C ~ 155°C; Package / Case: 0603 (1608 Metric); Supplier Device Package: 0603; Size / Dimension: 0.063" L x 0.031" W (1.60mm x 0.80mm); Height: 0.022" (0.55mm); Number of Terminations: 2; Failure Rate: -; ComponentLink1URL: http://www.yageo.com/documents/recent/PYu-RC_Group_51_RoHS_L_04.pdf; ComponentLink1Description: http://www.yageo.com/documents/recent/PYu-RC_Group_51_RoHS_L_04.pdf; Supplier Part Number 1: 311-330GRCT-ND
RTERM1 = Res330_0603
UC1 = CMP-0186-00035-2: Stand-Alone CAN Controller With SPI Interface, 18-Pin SOIC, Extended Temperature; RevisionNote: URLs added. DatasheetVersion updated.; DatasheetVersion: revF, Oct-2010; ComponentLink2Description: Datasheet; ComponentLink3Description: Package Specification; ComponentLink1Description: Manufacturer URL; PackageReference: SOIC-SO18; PackageDescription: 18-Lead Plastic Small Outline (SO) - Wide 7.50mm Body [SOIC]; PackageVersion: revBB, Aug-2009; ComponentLink1URL: http://www.microchip.com/; ComponentLink3URL: http://www.microchip.com/stellent/groups/techpub_sg/documents/packagingspec/en012702.pdf; ComponentLink2URL: http://ww1.microchip.com/downloads/en/DeviceDoc/21801f.pdf; Code_JEDEC: MS-013
UC2 = CMP-0186-00038-2: High-Speed CAN Transceiver, 8-Pin SOIC, Extended Temperature; PackageReference: SOIC-SN8; Code_JEDEC: MS-012; ComponentLink1Description: Manufacturer URL; ComponentLink1URL: http://www.microchip.com/; PackageVersion: revBB, Aug-2009; ComponentLink3Description: Package Specification; Code_IPC: SOIC127P600-8; ComponentLink2URL: http://ww1.microchip.com/downloads/en/DeviceDoc/21667F.pdf; RevisionNote: URLs added. DatasheetVersion updated.; ComponentLink3URL: http://www.microchip.com/stellent/groups/techpub_sg/documents/packagingspec/en012702.pdf; DatasheetVersion: revF, Jul-2010; ComponentLink2Description: Datasheet; PackageDescription: 8-Lead Plastic Small Outline (SN) - Narrow, 3.90mm Body [SOIC]
X1 = CMP-0464-00001-2: Crystal, 16 MHz, -30 to 85 degC, 3.2 x 2.5 x 0.9 mm SMD; Manufacturer: ITTI; Frequency Tolerance: +/-20 ppm; Load Capacitance: 10 pF; Drive Level: 100 max. uw; Nominal Frequency: 16 MHz; Overtone order: Fundamental; ComponentLink1Description: Manufacturer URL; PackageDescription: 4-Pin Hand Drawn, Body 3.2 x 2.5mm; ComponentLink1URL: http://www.itti-co.com; PartNumber: 21C00047-16.000MHz; Operating temperature: -30 to 85 degC; PackageReference: 21C00047-16.000MHz-4; Mounting Technology: Surface Mount

## Sheet Digital_IO.SchDoc: Digital IO Expansion Logic
size B; Engineer: Z Transform; DocumentNumber: 2; Revision: 1.1; SheetNumber: 2; SheetTotal: 5
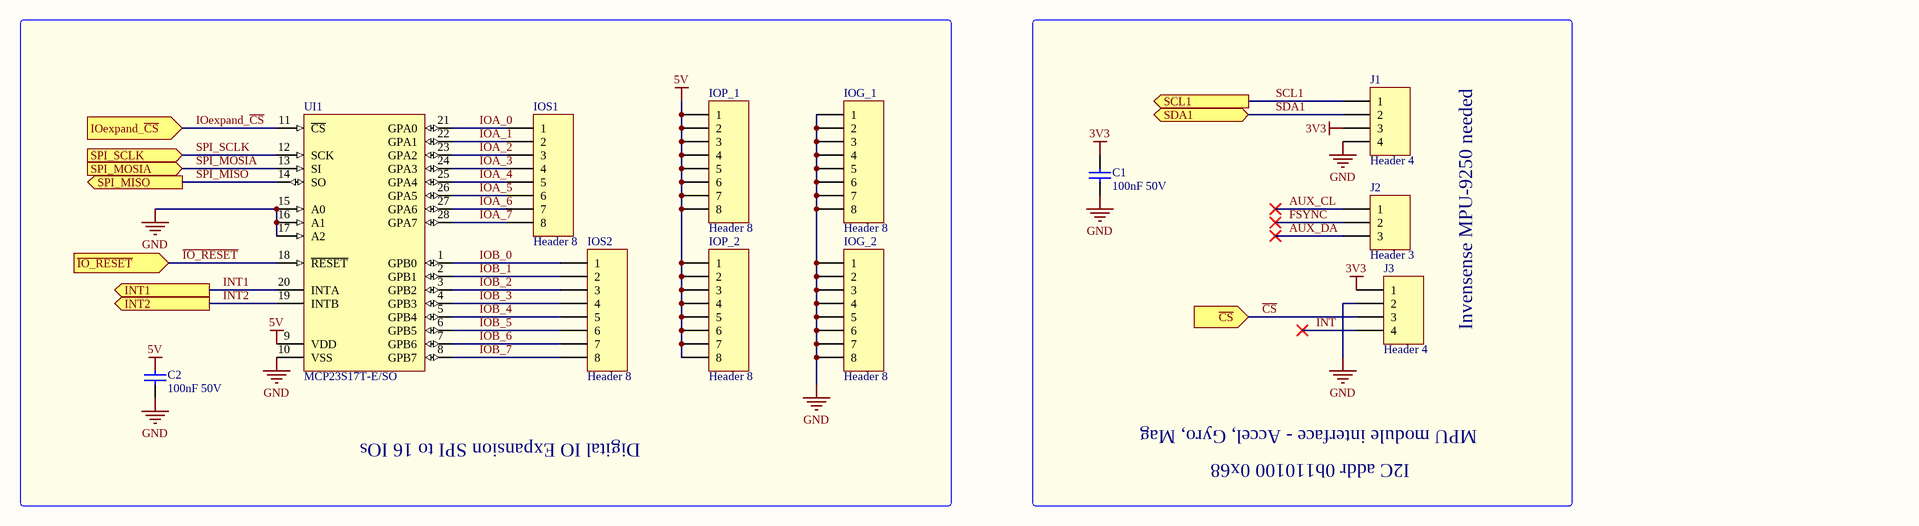
[diagram p3: Digital_IO.SchDoc]

### Parts
C1  100nF 50V  [0603C_L]
C2  100nF 50V  [0603C_L]
IOG_1  Header 8  [HDR1X8]
IOG_2  Header 8  [HDR1X8]
IOP_1  Header 8  [HDR1X8]
IOP_2  Header 8  [HDR1X8]
IOS1  Header 8  [HDR1X8]
IOS2  Header 8  [HDR1X8]
J1  Header 4  [HDR1X4]
J2  Header 3  [HDR1X3]
J3  Header 4  [HDR1X4]
UI1  MCP23S17T-E/SO  [SOIC-SO28_L]

### Blocks framed on the sheet
Digital IO Expansion SPI to 16 IOs: C2 IOG_1 IOG_2 IOP_1 IOP_2 IOS1 IOS2 UI1

### Ports
INT1 (out), INT2 (out), IOexpand_~{CS} (in), SCL1 (out), SDA1 (bidir), SPI_MISO (out), SPI_MOSIA (in), SPI_SCLK (in), ~{CS} (in), ~{IO_RESET} (in)

### Nets
3V3: C1.2 J1.3 J3.1
5V: IOP_1.1 IOP_1.2 IOP_1.3 IOP_1.4 IOP_1.5 IOP_1.6 IOP_1.7 IOP_1.8 IOP_2.1 IOP_2.2 IOP_2.3 IOP_2.4 IOP_2.5 IOP_2.6 IOP_2.7 IOP_2.8 UI1.9(VDD)
GND: C1.1 C2.1 IOG_1.1 IOG_1.2 IOG_1.3 IOG_1.4 IOG_1.5 IOG_1.6 IOG_1.7 IOG_1.8 IOG_2.1 IOG_2.2 IOG_2.3 IOG_2.4 IOG_2.5 IOG_2.6 IOG_2.7 IOG_2.8 J1.4 J3.2 UI1.10(VSS) UI1.15(A0) UI1.16(A1) UI1.17(A2)
~{IO_RESET}: UI1.18(~{RESET}) ; port ~{IO_RESET}
AUX_CL: J2.1
AUX_DA: J2.3
~{CS}: J3.3 ; port ~{CS}
FSYNC: J2.2
INT: J3.4
INT1: UI1.20(INTA) ; port INT1  [project net GPIO12]
INT2: UI1.19(INTB) ; port INT2  [project net GPIO16]
IOA_0: IOS1.1 UI1.21(GPA0)
IOA_1: IOS1.2 UI1.22(GPA1)
IOA_2: IOS1.3 UI1.23(GPA2)
IOA_3: IOS1.4 UI1.24(GPA3)
IOA_4: IOS1.5 UI1.25(GPA4)
IOA_5: IOS1.6 UI1.26(GPA5)
IOA_6: IOS1.7 UI1.27(GPA6)
IOA_7: IOS1.8 UI1.28(GPA7)
IOB_0: IOS2.1 UI1.1(GPB0)
IOB_1: IOS2.2 UI1.2(GPB1)
IOB_2: IOS2.3 UI1.3(GPB2)
IOB_3: IOS2.4 UI1.4(GPB3)
IOB_4: IOS2.5 UI1.5(GPB4)
IOB_5: IOS2.6 UI1.6(GPB5)
IOB_6: IOS2.7 UI1.7(GPB6)
IOB_7: IOS2.8 UI1.8(GPB7)
IOexpand_~{CS}: UI1.11(~{CS}) ; port IOexpand_~{CS}  [project net GPIO4]
SCL1: J1.1 ; port SCL1  [project net GPIO3]
SDA1: J1.2 ; port SDA1  [project net GPIO2]
SPI_MISO: UI1.14(SO) ; port SPI_MISO
SPI_MOSIA: UI1.13(SI) ; port SPI_MOSIA
SPI_SCLK: UI1.12(SCK) ; port SPI_SCLK

Not connected (* = marked no-connect by the designer): C2 2

### Notes on the sheet
- Invensense MPU-9250 needed
- MPU module interface - Accel, Gyro, Mag
- I2C addr 0b110100 0x68
- Labels drawn without touching a wire or pin: 5V
- Title
- Size:
- Date:
- B
- Project:
- Time:
- Revision:
- Sheet
- of
- Engineer:
- File:

### Library data of the parts
C1 C2 = Cap100nF_50V_0603: as CSS1 on sheet Power Supply; Supplier 1: Digi-Key; Supplier Part Number 1: 311-1343-1-ND; RoHS: RoHS Compliant; Category: Capacitors; Stock 1: 1827128; Pricing 1: 1=0.1, 10=0.018, 25=0.0128, 100=0.0082, 250=0.00672, 500=0.00574, 1000=0.00447 (USD); Packaging: Cut Tape (CT); Part Status: Active; Voltage - Rated: 50V; Operating Temperature: -30°C ~ 85°C; Features: -; Ratings: -; Applications: General Purpose; Failure Rate: -; Mounting Type: Surface Mount, MLCC; Package / Case: 0603 (1608 Metric); Size / Dimension: 0.063" L x 0.031" W (1.60mm x 0.80mm); Height - Seated (Max): -; Thickness (Max): 0.035" (0.90mm); Lead Spacing: -; Lead Style: -; ComponentLink1URL: http://www.yageo.com/documents/recent/UPY-GPHC_Y5V_6.3V-to-50V_6.pdf; ComponentLink1Description: http://www.yageo.com/documents/recent/UPY-GPHC_Y5V_6.3V-to-50V_6.pdf
IOG_1 IOG_2 IOP_1 IOP_2 IOS1 IOS2 = Header 8: Header, 8-Pin; LatestRevisionDate: 17-Jul-2002; LatestRevisionNote: Re-released for DXP Platform.; Publisher: Altium Limited
J1 J3 = Header 4: Header, 4-Pin; LatestRevisionDate: 17-Jul-2002; LatestRevisionNote: Re-released for DXP Platform.; Publisher: Altium Limited
J2 = Header 3: Header, 3-Pin; LatestRevisionDate: 17-Jul-2002; LatestRevisionNote: Re-released for DXP Platform.; Publisher: Altium Limited
UI1 = CMP-0186-00131-2: 16-Bit I/O Expander with Serial Interface, 28-Pin SOIC, Extended Temperature, Tape and Reel; PackageDescription: 28-Lead Plastic Small Outline (SO) - Wide 7.50mm Body [SOIC]; ComponentLink1URL: http://www.microchip.com/; Code_JEDEC: MS-013; ComponentLink3URL: http://www.microchip.com/stellent/groups/techpub_sg/documents/packagingspec/en012702.pdf; DatasheetVersion: revB, Feb-2007; ComponentLink2URL: http://ww1.microchip.com/downloads/en/DeviceDoc/21952b.pdf; ComponentLink2Description: Datasheet; ComponentLink3Description: Package Specification; PackageReference: SOIC-SO28; RevisionNote: URLs added. Sch pin type corrected.; ComponentLink1Description: Manufacturer URL; PackageVersion: revBB, Aug-2009